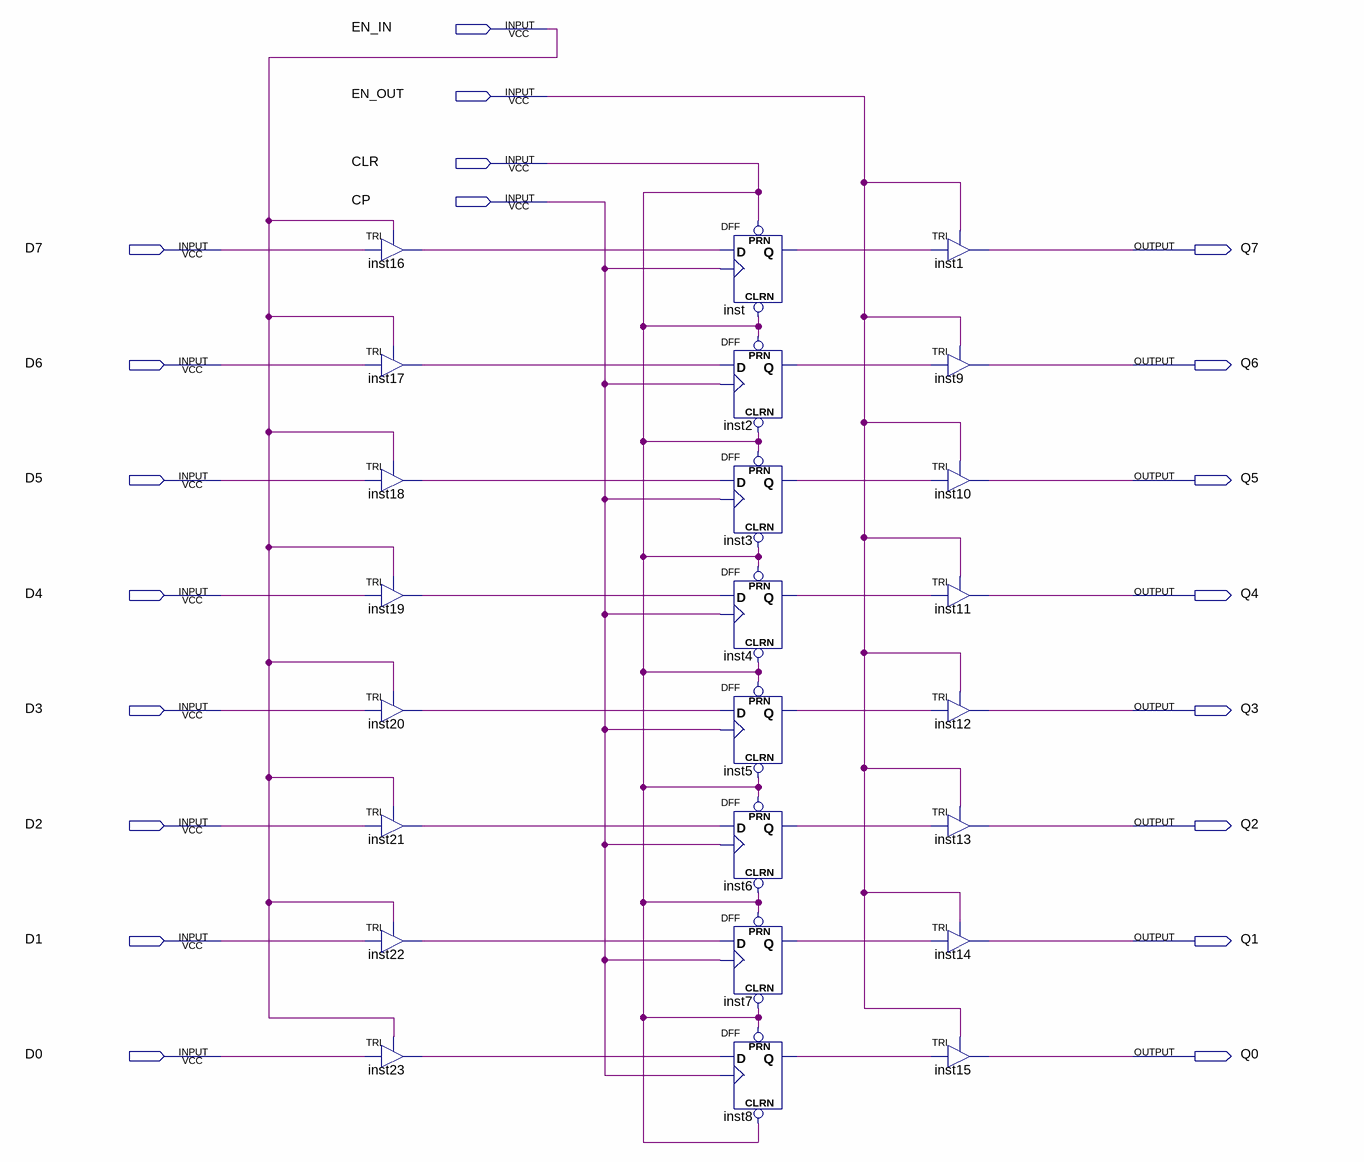
[diagram p0: schematic sheet]
// Quartus schematic register_8b_premium.bdf as structural Verilog: 24 symbols, 20 pins
module register_8b_premium (
  input  EN_IN,
  input  EN_OUT,
  input  CLR,
  input  CP,
  input  D7,
  input  D6,
  input  D5,
  input  D4,
  input  D3,
  input  D2,
  input  D1,
  input  D0,
  output Q7,
  output Q6,
  output Q5,
  output Q4,
  output Q3,
  output Q2,
  output Q1,
  output Q0
);

  wire inst2_q, inst3_q, inst4_q, inst5_q, inst6_q, inst7_q, inst8_q, inst16_out, inst17_out, inst18_out,
       inst19_out, inst20_out, inst21_out, inst22_out, inst23_out, inst_q;

  TRI inst16 (.IN(D7), .OE(EN_IN), .OUT(inst16_out));
  TRI inst17 (.IN(D6), .OE(EN_IN), .OUT(inst17_out));
  TRI inst18 (.IN(D5), .OE(EN_IN), .OUT(inst18_out));
  TRI inst19 (.IN(D4), .OE(EN_IN), .OUT(inst19_out));
  TRI inst20 (.IN(D3), .OE(EN_IN), .OUT(inst20_out));
  TRI inst21 (.IN(D2), .OE(EN_IN), .OUT(inst21_out));
  TRI inst22 (.IN(D1), .OE(EN_IN), .OUT(inst22_out));
  TRI inst23 (.IN(D0), .OE(EN_IN), .OUT(inst23_out));
  DFF inst (.CLRN(CLR), .CLK(CP), .D(inst16_out), .PRN(CLR), .Q(inst_q));
  DFF inst2 (.CLRN(CLR), .CLK(CP), .D(inst17_out), .PRN(CLR), .Q(inst2_q));
  DFF inst3 (.CLRN(CLR), .CLK(CP), .D(inst18_out), .PRN(CLR), .Q(inst3_q));
  DFF inst4 (.CLRN(CLR), .CLK(CP), .D(inst19_out), .PRN(CLR), .Q(inst4_q));
  DFF inst5 (.CLRN(CLR), .CLK(CP), .D(inst20_out), .PRN(CLR), .Q(inst5_q));
  DFF inst6 (.CLRN(CLR), .CLK(CP), .D(inst21_out), .PRN(CLR), .Q(inst6_q));
  DFF inst7 (.CLRN(CLR), .CLK(CP), .D(inst22_out), .PRN(CLR), .Q(inst7_q));
  DFF inst8 (.CLRN(CLR), .CLK(CP), .D(inst23_out), .PRN(CLR), .Q(inst8_q));
  TRI inst1 (.IN(inst_q), .OE(EN_OUT), .OUT(Q7));
  TRI inst9 (.IN(inst2_q), .OE(EN_OUT), .OUT(Q6));
  TRI inst10 (.IN(inst3_q), .OE(EN_OUT), .OUT(Q5));
  TRI inst11 (.IN(inst4_q), .OE(EN_OUT), .OUT(Q4));
  TRI inst12 (.IN(inst5_q), .OE(EN_OUT), .OUT(Q3));
  TRI inst13 (.IN(inst6_q), .OE(EN_OUT), .OUT(Q2));
  TRI inst14 (.IN(inst7_q), .OE(EN_OUT), .OUT(Q1));
  TRI inst15 (.IN(inst8_q), .OE(EN_OUT), .OUT(Q0));
endmodule
